# Altium schematic sheet Cap_ESP_ADS1298.SchDoc
size A3
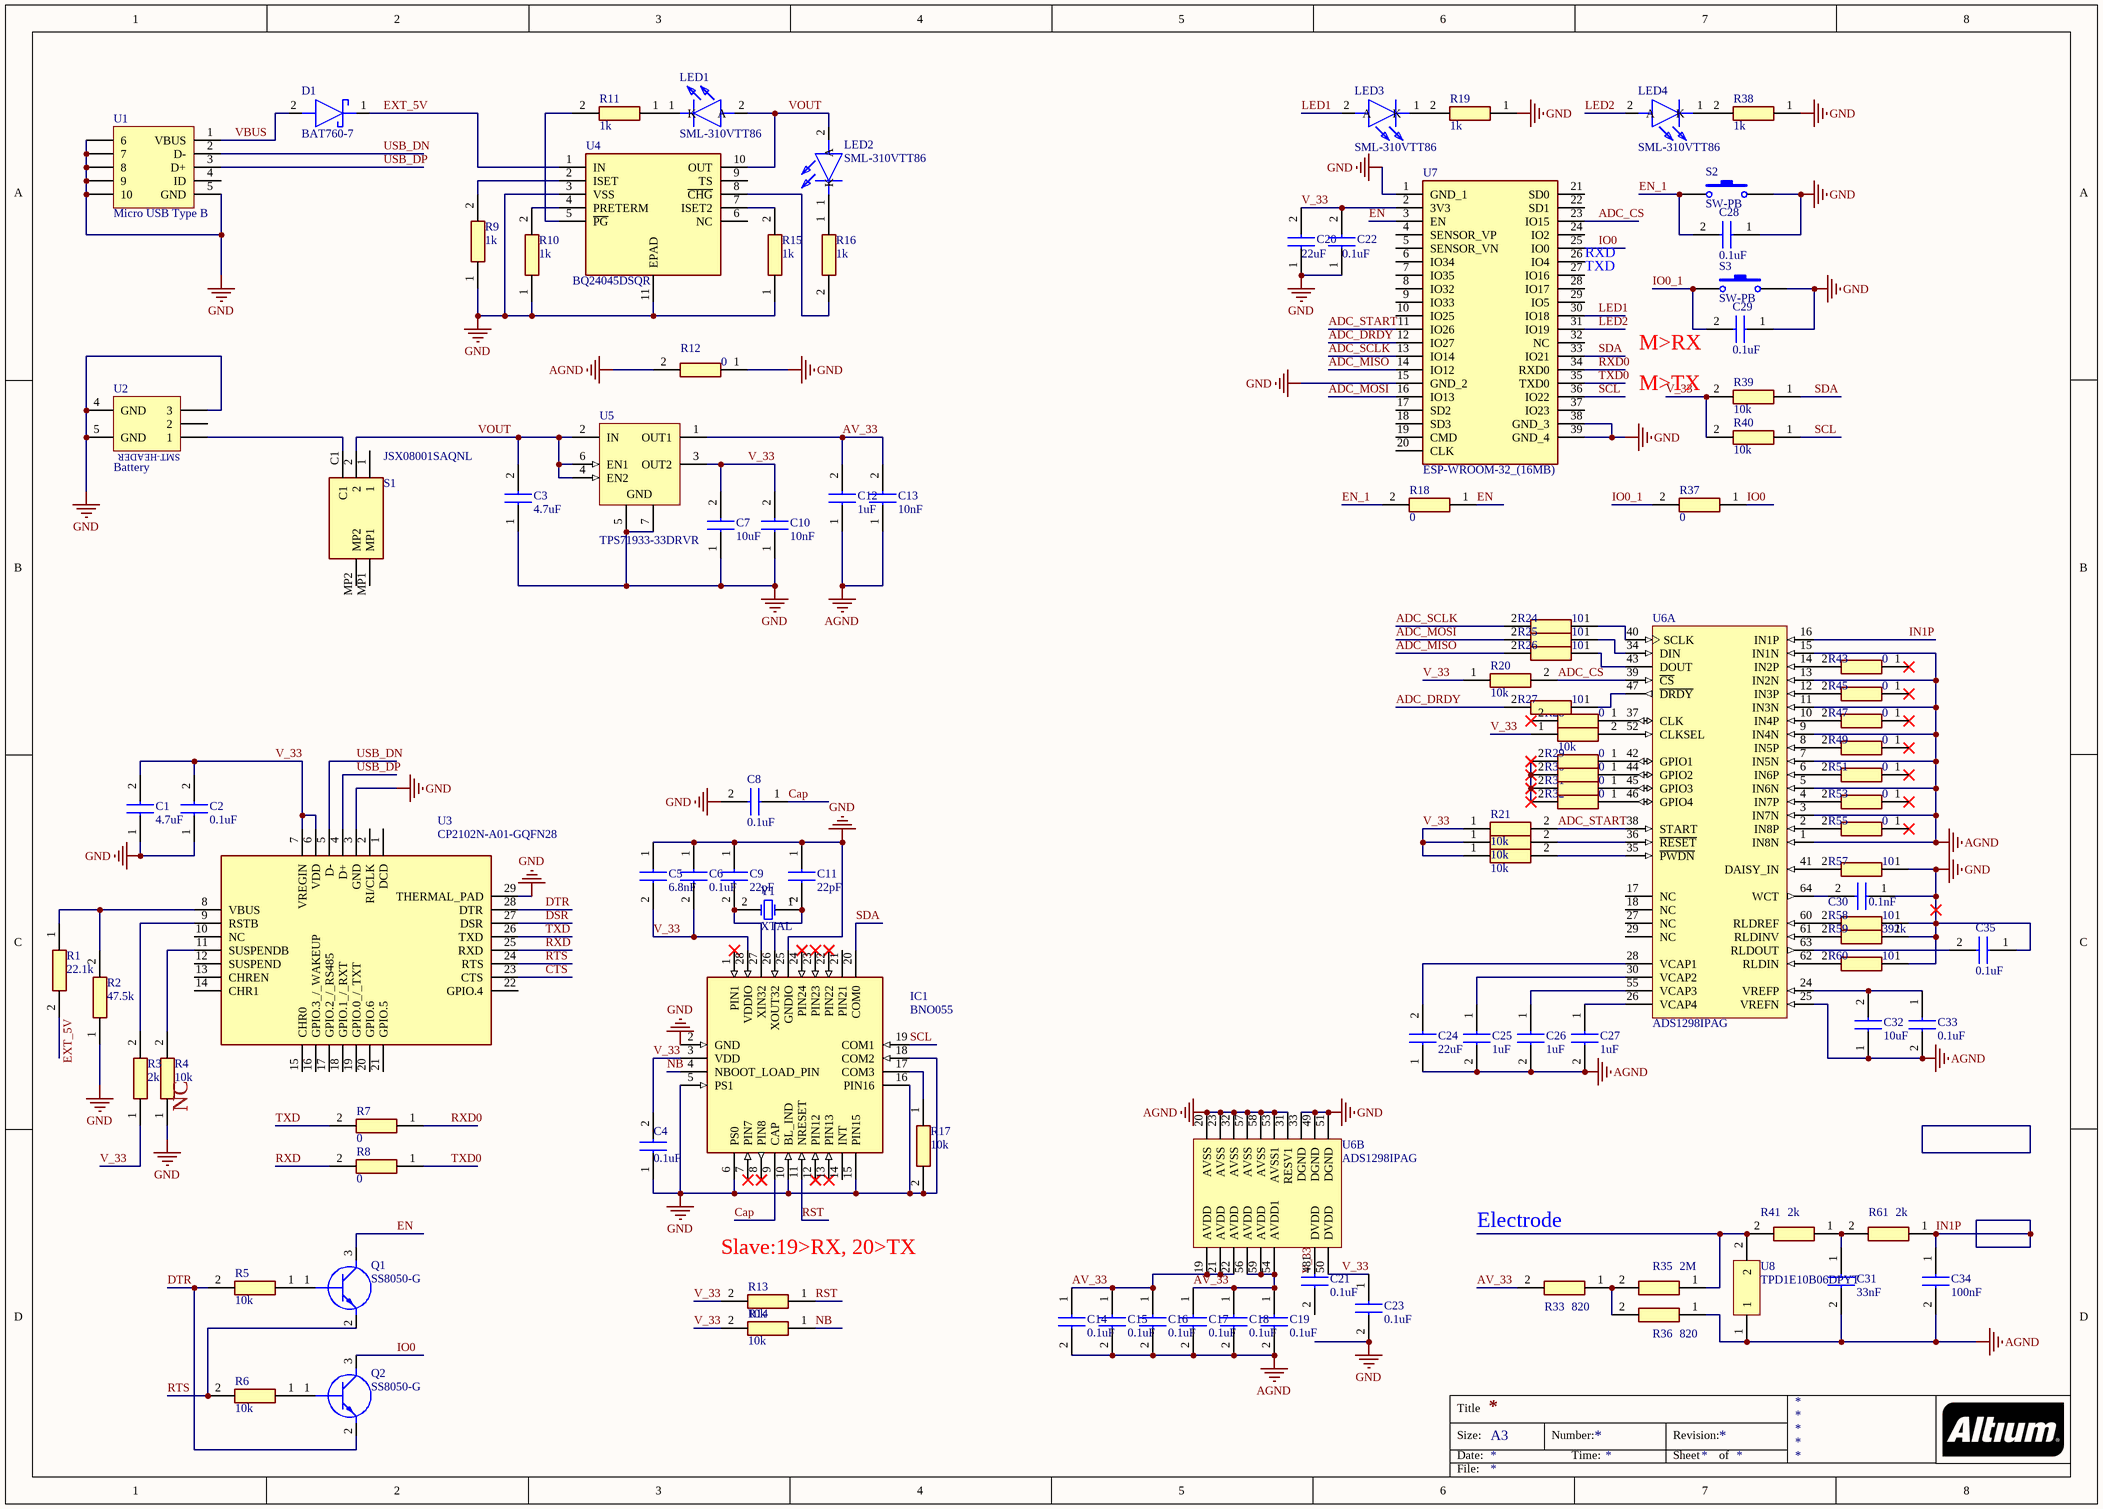
[diagram p0: Cap_ESP_ADS1298.SchDoc]

## Parts
C1  4.7uF  [CAPC1005X55N]
C2  0.1uF  [CAPC1005X55N]
C3  4.7uF  [1608[0603]]
C4  0.1uF  [CAPC1005X55N]
C5  6.8nF  [CAPC1005X55N]
C6  0.1uF  [CAPC1005X55N]
C7  10uF  [CAPC1005X55N]
C8  0.1uF  [CAPC1005X55N]
C9  22pF  [CAPC1005X55N]
C10  10nF  [CAPC1005X55N]
C11  22pF  [CAPC1005X55N]
C12  1uF  [CAPC1005X55N]
C13  10nF  [CAPC1005X55N]
C14  0.1uF  [CAPC1005X55N]
C15  0.1uF  [CAPC1005X55N]
C16  0.1uF  [CAPC1005X55N]
C17  0.1uF  [CAPC1005X55N]
C18  0.1uF  [CAPC1005X55N]
C19  0.1uF  [CAPC1005X55N]
C20  22uF  [6-0805_N]
C21  0.1uF  [CAPC1005X55N]
C22  0.1uF  [CAPC1005X55N]
C23  0.1uF  [CAPC1005X55N]
C24  22uF  [CAPC1005X55N]
C25  1uF  [CAPC1005X55N]
C26  1uF  [CAPC1005X55N]
C27  1uF  [CAPC1005X55N]
C28  0.1uF  [CAPC1005X55N]
C29  0.1uF  [CAPC1005X55N]
C30  0.1nF  [CAPC1005X55N]
C31  33nF  [1608[0603]]
C32  10uF  [CAPC1005X55N]
C33  0.1uF  [CAPC1005X55N]
C34  100nF  [1608[0603]]
C35  0.1uF  [CAPC1005X55N]
D1  BAT760-7  [SOD2513X120N]
IC1  BNO055  [BNO055]
LED1  SML-310VTT86  [LEDC1608X80N]
LED2  SML-310VTT86  [LEDC1608X80N]
LED3  SML-310VTT86  [LEDC1608X80N]
LED4  SML-310VTT86  [LEDC1608X80N]
Q1  SS8050-G  [SOT95P240X115-3N]
Q2  SS8050-G  [SOT95P240X115-3N]
R1  22.1k  [RESC1005X40N]
R2  47.5k  [RESC1005X40N]
R3  2k  [RESC1005X40N]
R4  10k  [RESC1005X40N]
R5  10k  [RESC1005X40N]
R6  10k  [RESC1005X40N]
R7  0  [RESC1005X40N]
R8  0  [RESC1005X40N]
R9  1k  [RESC1005X40N]
R10  1k  [RESC1005X40N]
R11  1k  [RESC1005X40N]
R12  0  [1608[0603]]
R13  10k  [0402]
R14  10k  [0402]
R15  1k  [RESC1005X40N]
R16  1k  [RESC1005X40N]
R17  10k  [0402]
R18  0  [RESC1005X40N]
R19  1k  [RESC1005X40N]
R20  10k  [RESC1005X40N]
R21  10k  [RESC1005X40N]
R22  10k  [RESC1005X40N]
R23  10k  [RESC1005X40N]
R24  10  [RESC1005X40N]
R25  10  [RESC1005X40N]
R26  10  [RESC1005X40N]
R27  10  [RESC1005X40N]
R28  0  [RESC1005X40N]
R29  0  [RESC1005X40N]
R30  0  [RESC1005X40N]
R31  0  [RESC1005X40N]
R32  0  [RESC1005X40N]
R33  820  [1608[0603]]
R34  10k  [RESC1005X40N]
R35  2M  [1608[0603]]
R36  820  [1608[0603]]
R37  0  [RESC1005X40N]
R38  1k  [RESC1005X40N]
R39  10k  [RESC1005X40N]
R40  10k  [RESC1005X40N]
R41  2k  [1608[0603]]
R43  0  [RESC1005X40N]
R45  0  [RESC1005X40N]
R47  0  [RESC1005X40N]
R49  0  [RESC1005X40N]
R51  0  [RESC1005X40N]
R53  0  [RESC1005X40N]
R55  0  [RESC1005X40N]
R57  10  [RESC1005X40N]
R58  10  [RESC1005X40N]
R59  392k  [RESC1005X40N]
R60  10  [RESC1005X40N]
R61  2k  [1608[0603]]
S1  JSX08001SAQNL  [JSX08001SAQNL]
S2  SW-PB  [SPSD_Switch_B3U100P]
S3  SW-PB  [SPSD_Switch_B3U100P]
U1  Micro USB Type B  [Micro USB Type B]
U2  Battery  [Battery Header]
U3  CP2102N-A01-GQFN28  [QFN50P500X500X80-29N-D]
U4  BQ24045DSQR  [SON40P200X200X80-11N]
U5  TPS71933-33DRVR  [TI-DRV6-1600X1000TP_V]
U6  ADS1298IPAG  [TI-PAG64_N]  (parts A,B of 2)
U7  ESP-WROOM-32_(16MB)  [ESP32WROOM32D]
U8  TPD1E10B06DPYT  [DPY2_N]
Y1  XTAL  [6-0805_L]

## Nets
AGND: C12.1 C13.1 C14.2 C15.2 C16.2 C17.2 C18.2 C19.2 C24.1 C25.2 C26.2 C27.2 C31.2 C32.1 C33.2 C34.2 R12.2 R36.1 U6.1(IN8N) U6.3(IN7N) U6.5(IN6N) U6.7(IN5N) U6.9(IN4N) U6.11(IN3N) U6.13(IN2N) U6.15(IN1N) U6.20(AVSS) U6.23(AVSS) U6.25(VREFN) U6.31(RESV1) U6.32(AVSS) U6.53(AVSS1) U6.57(AVSS) U6.58(AVSS) U8.1
GND: C1.1 C2.1 C3.1 C4.1 C5.1 C6.1 C7.1 C8.2 C9.1 C10.1 C11.1 C20.1 C22.1 C23.2 C28.1 C29.1 C30.1 C35.1 IC1.2(GND) IC1.5(PS1) IC1.6(PS0) IC1.10(BL_IND) IC1.15(PIN15) IC1.16(PIN16) IC1.18(COM2) IC1.25(GNDIO) R2.1 R4.1 R9.1 R10.1 R12.1 R15.1 R17.2 R19.1 R38.1 R57.1 R58.1 R59.1 R60.1 S2.2 S3.2 U1.5(GND) U1.6 U1.7 U1.8 U1.9 U1.10 U2.3 U2.4(GND) U2.5(GND) U3.3(GND) U3.29(THERMAL_PAD) U4.3(VSS) U4.11(EPAD) U5.5(GND) U5.7(GND) U6.33(DGND) U6.49(DGND) U6.51(DGND) U7.1(GND_1) U7.15(GND_2) U7.38(GND_3) U7.39(GND_4)
ADC_CS: R20.2 U6.39(~{CS}) U7.23(IO15)
ADC_DRDY: R27.2 U7.12(IO27)
ADC_MISO: R26.2 U7.14(IO12)
ADC_MOSI: R25.2 U7.16(IO13)
ADC_SCLK: R24.2 U7.13(IO14)
ADC_START: R21.2 U6.38(START) U7.11(IO26)
AV_33: C12.2 C13.2 C14.1 C15.1 C16.1 C17.1 C18.1 C19.1 R33.2 U5.1(OUT1) U6.19(AVDD) U6.21(AVDD) U6.22(AVDD) U6.54(AVDD1) U6.56(AVDD) U6.59(AVDD)
Cap: C8.1 IC1.9(CAP)
CTS: U3.23(CTS)
DSR: U3.27(DSR)
DTR: Q2.2(E) R5.2 U3.28(DTR)
EN: Q1.3(C) R18.1 U7.3(EN)
EN_1: C28.2 R18.2 S2.1
EXT_5V: D1.1(K) R1.2 U4.1(IN)
IN1P: C34.1 R61.1 U6.16(IN1P)
IO0: Q2.3(C) R37.1 U7.25(IO0)
IO0_1: C29.2 R37.2 S3.1
LED1: LED3.2(A) U7.30(IO18)
LED2: LED4.2(A) U7.31(IO19)
NB: IC1.4(NBOOT_LOAD_PIN) R14.1
RST: IC1.11(NRESET) R13.1
RTS: Q1.2(E) R6.2 U3.24(RTS)
RXD: R8.2 U3.25(RXD)
RXD0: R7.1 U7.34(RXD0)
SCL: IC1.19(COM1) R40.1 U7.36(IO22)
SDA: IC1.20(COM0) R39.1 U7.33(IO21)
TXD: R7.2 U3.26(TXD)
TXD0: R8.1 U7.35(TXD0)
USB_DN: U1.2(D-) U3.5(D-)
USB_DP: U1.3(D+) U3.4(D+)
V_33: C1.2 C2.2 C4.2 C5.2 C6.2 C7.2 C10.2 C20.2 C22.2 C23.1 IC1.3(VDD) IC1.28(VDDIO) R3.1 R13.2 R14.2 R20.1 R21.1 R22.1 R23.1 R34.1 R39.2 R40.2 U3.6(VDD) U3.7(VREGIN) U5.3(OUT2) U6.48(DVDD) U6.50(DVDD) U7.2(3V3)
VBUS: D1.2(A) U1.1(VBUS)
VOUT: C3.2 LED1.2(A) LED2.2(A) S1.2 U4.10(OUT) U5.2(IN) U5.4(EN2) U5.6(EN1)
NetC9_2: C9.2 IC1.27(XIN32) Y1.2(OSC2)
NetC11_2: C11.2 IC1.26(XOUT32) Y1.1(OSC1)
NetC24_2: C24.2 U6.28(VCAP1)
NetC25_1: C25.1 U6.30(VCAP2)
NetC26_1: C26.1 U6.55(VCAP3)
NetC27_1: C27.1 U6.26(VCAP4)
NetC30_2: C30.2 U6.64(WCT)
NetC31_1: C31.1 R41.1 R61.2
NetC32_2: C32.2 C33.1 U6.24(VREFP)
NetC35_2: C35.2 U6.63(RLDOUT)
NetIC1_17: IC1.17(COM3) R17.1
NetLED1_1: LED1.1(K) R11.1
NetLED2_1: LED2.1(K) R16.1
NetLED3_1: LED3.1(K) R19.2
NetLED4_1: LED4.1(K) R38.2
NetQ1_1: Q1.1(B) R5.1
NetQ2_1: Q2.1(B) R6.1
NetR1_1: R1.1 R2.2 U3.8(VBUS)
NetR3_2: R3.2 U3.9(RSTB)
NetR4_2: R4.2 U3.11(SUSPENDB)
NetR9_2: R9.2 U4.2(ISET)
NetR10_2: R10.2 U4.4(PRETERM)
NetR11_2: R11.2 U4.5(~{PG})
NetR15_2: R15.2 U4.7(ISET2)
NetR16_2: R16.2 U4.8(~{CHG})
NetR22_2: R22.2 U6.36(~{RESET})
NetR23_2: R23.2 U6.35(~{PWDN})
NetR24_1: R24.1 U6.40(SCLK)
NetR25_1: R25.1 U6.34(DIN)
NetR26_1: R26.1 U6.43(DOUT)
NetR27_1: R27.1 U6.47(~{DRDY})
NetR28_1: R28.1 U6.37(CLK)
NetR29_1: R29.1 U6.42(GPIO1)
NetR29_2: R29.2 R30.2 R31.2 R32.2
NetR30_1: R30.1 U6.44(GPIO2)
NetR31_1: R31.1 U6.45(GPIO3)
NetR32_1: R32.1 U6.46(GPIO4)
NetR33_1: R33.1 R35.2 R36.2
NetR34_2: R34.2 U6.52(CLKSEL)
NetR35_1: R35.1 R41.2 U8.2
NetR43_2: R43.2 U6.14(IN2P)
NetR45_2: R45.2 U6.12(IN3P)
NetR47_2: R47.2 U6.10(IN4P)
NetR49_2: R49.2 U6.8(IN5P)
NetR51_2: R51.2 U6.6(IN6P)
NetR53_2: R53.2 U6.4(IN7P)
NetR55_2: R55.2 U6.2(IN8P)
NetR57_2: R57.2 U6.41(DAISY_IN)
NetR58_2: R58.2 U6.60(RLDREF)
NetR59_2: R59.2 U6.61(RLDINV)
NetR60_2: R60.2 U6.62(RLDIN)
NetS1_C1: S1.C1 U2.1

Not connected (* = marked no-connect by the designer): C21 1 2; IC1 1(PIN1)* 7(PIN7)* 8(PIN8)* 12(PIN12)* 13(PIN13)* 14(INT) 21(PIN21) 22(PIN22)* 23(PIN23)* 24(PIN24)*; R28 2*; R43 1*; R45 1*; R47 1*; R49 1*; R51 1*; R53 1*; R55 1*; S1 1 MP1 MP2; U1 4(ID); U2 2; U3 1(DCD) 2(RI/CLK) 10(NC) 12(SUSPEND) 13(CHREN) 14(CHR1) 15(CHR0) 16(GPIO.3_/_WAKEUP) 17(GPIO.2_/_RS485) 18(GPIO.1_/_RXT) 19(GPIO.0_/_TXT) 20(GPIO.6) 21(GPIO.5) 22(GPIO.4); U4 6(NC) 9(TS); U6 17(NC) 18(NC) 27(NC) 29(NC); U7 4(SENSOR_VP) 5(SENSOR_VN) 6(IO34) 7(IO35) 8(IO32) 9(IO33) 10(IO25) 17(SD2) 18(SD3) 19(CMD) 20(CLK) 21(SD0) 22(SD1) 24(IO2) 26(IO4) 27(IO16) 28(IO17) 29(IO5) 32(NC) 37(IO23)

## Notes on the sheet
- (near U7) RXD
- (near U7) TXD
- M>RX
- M>TX
- (near R4) NC
- (near R13) Slave:19>RX, 20>TX
- Electrode
- Title
- Size:
- Date:
- A3
- Number:
- Time:
- Revision:
- Sheet
- of
- File:
- (in symbol Battery Header) SMT-HEADER

## Library data of the parts
C1-C35 = C0402C829D3GACTU: Capacitor; Manufacturer_Name: Kemet; Datasheet Link: https://content.kemet.com/datasheets/KEM_C1002_X7R_SMD.pdf; Height: 0.55mm; Manufacturer_Part_Number: C0402C829D3GACTU; Mouser Part Number: 80-C0402C829D3G; Mouser Price/Stock: https://www.mouser.com/Search/Refine.aspx?Keyword=80-C0402C829D3G
D1 = BAT760-7: Schottky Diode; Manufacturer_Name: Diodes Inc.; Datasheet Link: https://componentsearchengine.com/Datasheets/1/BAT760-7.pdf; Height: 1.2mm; Mouser Part Number: 621-BAT760-7; Mouser Price/Stock: https://www.mouser.com/Search/Refine.aspx?Keyword=621-BAT760-7; Manufacturer_Part_Number: BAT760-7
IC1 = BNO055: Integrated Circuit; Manufacturer_Name: Bosch Sensortec; Datasheet Link: https://componentsearchengine.com/Datasheets/1/BNO055.pdf; Height: 1mm; Mouser Part Number: 262-BNO055; Mouser Price/Stock: https://www.mouser.com/Search/Refine.aspx?Keyword=262-BNO055; Manufacturer_Part_Number: BNO055
LED1-LED4 = SML-310VTT86: LED; Manufacturer_Name: ROHM Semiconductor; Allied_Number: 70522033; Datasheet Link: http://www.rohm.co.jp/documents/11401/2613878/2014E_LED.pdf; Height: 0.8mm; Manufacturer_Part_Number: SML-310VTT86; Mouser Part Number: 755-SML-310VTT86; Mouser Price/Stock: https://www.mouser.com/Search/Refine.aspx?Keyword=755-SML-310VTT86; RS Part Number: 7007926P; RS Price/Stock: http://uk.rs-online.com/web/p/products/7007926P; Allied Price/Stock: http://www.alliedelec.com/rohm-semiconductor-sml-310vtt86/70522033/
Q1 Q2 = SS8050-G: Transistor BJT NPN; Manufacturer_Name: Comchip Technology; Datasheet Link: https://componentsearchengine.com/Datasheets/1/SS8050-G.pdf; Height: 1.15mm; Mouser Part Number: 750-SS8050-G; Mouser Price/Stock: https://www.mouser.com/Search/Refine.aspx?Keyword=750-SS8050-G; Manufacturer_Part_Number: SS8050-G
R1-R41 R43 R45 R47 R49 R51 R53 R55 R57-R61 = CRCW040295R3FKED: Resistor; Manufacturer_Name: Vishay; Datasheet Link: http://www.vishay.com/docs/20035/dcrcwe3.pdf; Height: 0.4mm; Manufacturer_Part_Number: CRCW040295R3FKED; Mouser Part Number: 71-CRCW040295R3FKED; Mouser Price/Stock: https://www.mouser.com/Search/Refine.aspx?Keyword=71-CRCW040295R3FKED
S1 = JSX08001SAQNL: Switch; Manufacturer_Name: C&K Switches; Datasheet Link: https://www.mouser.com/datasheet/2/60/jsx-965351.pdf; Height: 1.2mm; Mouser Part Number: 611-JSX08001SAQNL; Manufacturer_Part_Number: JSX08001SAQNL
S2 S3 = SW-PB: Switch; Published: 24-Mar-1999; LatestRevisionDate: 17-Jul-2002; LatestRevisionNote: Re-released for DXP Platform.; PackageReference: SPST-2; Publisher: Altium Limited; PackageDescription: Switch; 2 Leads
U2 = Battery Header
U3 = CP2102N-A01-GQFN28: Integrated Circuit; Manufacturer_Name: Silicon Labs; Datasheet Link: https://componentsearchengine.com/Datasheets/1/CP2102N-A01-GQFN28.pdf; Height: 0.8mm; Mouser Part Number: 634-CP2102NA01GQFN28; Mouser Price/Stock: https://www.mouser.com/Search/Refine.aspx?Keyword=634-CP2102NA01GQFN28; Manufacturer_Part_Number: CP2102N-A01-GQFN28
U4 = BQ24045DSQR: Integrated Circuit; Manufacturer_Name: Texas Instruments; Datasheet Link: http://www.ti.com/lit/gpn/bq24045; Height: 0.8mm; Mouser Part Number: 595-BQ24045DSQR; Mouser Price/Stock: https://www.mouser.com/Search/Refine.aspx?Keyword=595-BQ24045DSQR; Manufacturer_Part_Number: BQ24045DSQR
U5 = TPS71933-33DRVR: Dual Output High PSRR LDO, 200 mA, Fixed 3.3 V Output, 2.7 to 6.5 V Input, 6-pin SON (DRV), -40 to 125 degC, Green (RoHS & no Sb/Br); Manufacturer: Texas Instruments; Fixed Output Options(V): 3.3; Iout(Max)(A): 0.2; Iq(Typ)(mA): 0.09; SubFamily: Dual Channel LDO; Vdo(Typ)(mV): 230; Vin(Max)(V): 6.5; Vin(Min)(V): 2.7; DatasheetVersion: SBVS088C; PackageVersion: 4206925/E; PackageReference: DRV6-1600X1000TP; PackageDescription: 6-Pin Plastic Small Outline No-Lead, Body 2 x 2 mm, Pitch 0.65 mm; Supplier 1: Digi-Key; Supplier Part Number 1: 296-21662-2-ND; Supplier 2: Digi-Key; Supplier Part Number 2: 296-21662-1-ND; Supplier 3: Digi-Key; Supplier Part Number 3: 296-21662-6-ND; Supplier 4: Newark; Supplier Part Number 4: 37M0080; Supplier 5: Mouser; Supplier Part Number 5: 595-TPS71933-33DRVR; Eco-Plan: Green (RoHS & no Sb/Br); Iout2(A): 0.2; Vout(Max)(V): 3.3; Vout(Min)(V): 3.3; Vout2(Max)(V): 3.3; Vout2(Min)(V): 3.3; Mounting Technology: Surface Mount; PartNumber: TPS71933-33DRVR; ComponentLink1Description: Manufacturer URL; ComponentLink1URL: http://www.ti.com/; ComponentLink2Description: Datasheet; ComponentLink2URL: http://www.ti.com/general/docs/lit/getliterature.tsp?genericPartNumber=TPS71933-33&fileType=pdf; ComponentLink3Description: Package Specification; ComponentLink3URL: http://www.ti.com/litv/pdf/mpds216d
U6 = ADS1298IPAG: 8-Channel, 24-Bit ADC with Integrated ECG Front End, -40 to 85 degC, 64-pin QFP (PAG64), Green (RoHS & no Sb/Br); Manufacturer: Texas Instruments; # Input Channels: 8; Analog Voltage AV/DD(Max)(V): 5.25; Analog Voltage AV/DD(Min)(V): 2.7; Architecture: Delta-Sigma; Digital Supply(Max)(V): 3.6; Digital Supply(Min)(V): 1.65; Interface: Serial SPI; Resolution(Bits): 24; Sample Rate (max)(SPS): 32K; SNR(dB): 112; SubFamily: Precision ADC (<=10MSPS); DatasheetVersion: SBAS459I; PackageVersion: 4040282/C, 11/1996; PackageReference: PAG64; PackageDescription: 64-Pin Plastic Flat Pack, Body 10 x 10 mm, Pitch 0.50 mm; Supplier 1: Digi-Key; Supplier Part Number 1: ADS828E/1K-ND; Supplier 2: Mouser; Supplier Part Number 2: 595-ADS828E/1K; Eco-Plan: Green (RoHS & no Sb/Br); Mounting Technology: Surface Mount; Code_JEDEC: MS-026; PartNumber: ADS1298IPAG; ComponentLink1Description: Manufacturer URL; ComponentLink1URL: http://www.ti.com/; ComponentLink2Description: Datasheet; ComponentLink2URL: http://www.ti.com/general/docs/lit/getliterature.tsp?genericPartNumber=ADS1298&fileType=pdf; ComponentLink3Description: Package Specification; ComponentLink3URL: http://www.ti.com/lit/ml/mtqf006a/mtqf006a.pdf
U7 = ESP-WROOM-32_(16MB): Integrated Circuit; Manufacturer_Name: Espressif; Manufacturer_Part_Number: ESP-WROOM-32 (16MB); Datasheet Link: https://www.mouser.com/datasheet/2/891/esp-wroom-32_datasheet_en-1365813.pdf; Height: 3.1mm; Mouser Part Number: 356-ESPWROOM3216MB
U8 = TPD1E10B06DPYT: ESD Protection in 0402 Package with 10 pF Capacitance and 6 V Breakdown, 1 Channel, -40 to +125 degC, 2-pin X2SON (DPY); Manufacturer: Texas Instruments; Breakdown Voltage(Min)(V): 6; Eco-Plan: TBD; IEC 61000-4-2 Air-Gap(+/- kV): 30; IO Capacitance(Typ)(pF): 10; SubFamily: ESD Solution; DatasheetVersion: SLLSEB1; PackageVersion: revA, Apr-2010; PackageReference: DPY2; PackageDescription: 2-Pin Plastic Small Outline No-Lead 1.0 x 0.6 x 0.4 mm Body; Supplier 1: Mouser; Supplier Part Number 1: N/A; IEC 61000-4-2 Contact(+/- kV): 30; IO Leakage Current(nA): 10; Mounting Technology: Surface Mount; PartNumber: TPD1E10B06DPYT; ComponentLink1Description: Datasheet; ComponentLink1URL: http://www.ti.com/general/docs/lit/getliterature.tsp?genericPartNumber=TPD1E10B06&fileType=pdf; ComponentLink2Description: URL Link1; ComponentLink2URL: SamplesURL:http://www.ti.com/product/tpd1e10b06#samples
Y1 = XTAL: Crystal Oscillator; Published: 8-Jun-2000; LatestRevisionDate: 17-Jul-2002; LatestRevisionNote: Re-released for DXP Platform.; PackageReference: R38; Publisher: Altium Limited; PackageDescription: Crystal, Thru-Hole; 2 Leads; Body 3.1 x 8.2 mm (Dia.xH)